# EasyEDA schematic UrLab_badge.json
TITLE: Badge UrLab; REV: 1.0; Date: 2019-04-30; Sheet: 1/1; Drawn By: altf4arnold; Company: UrLab
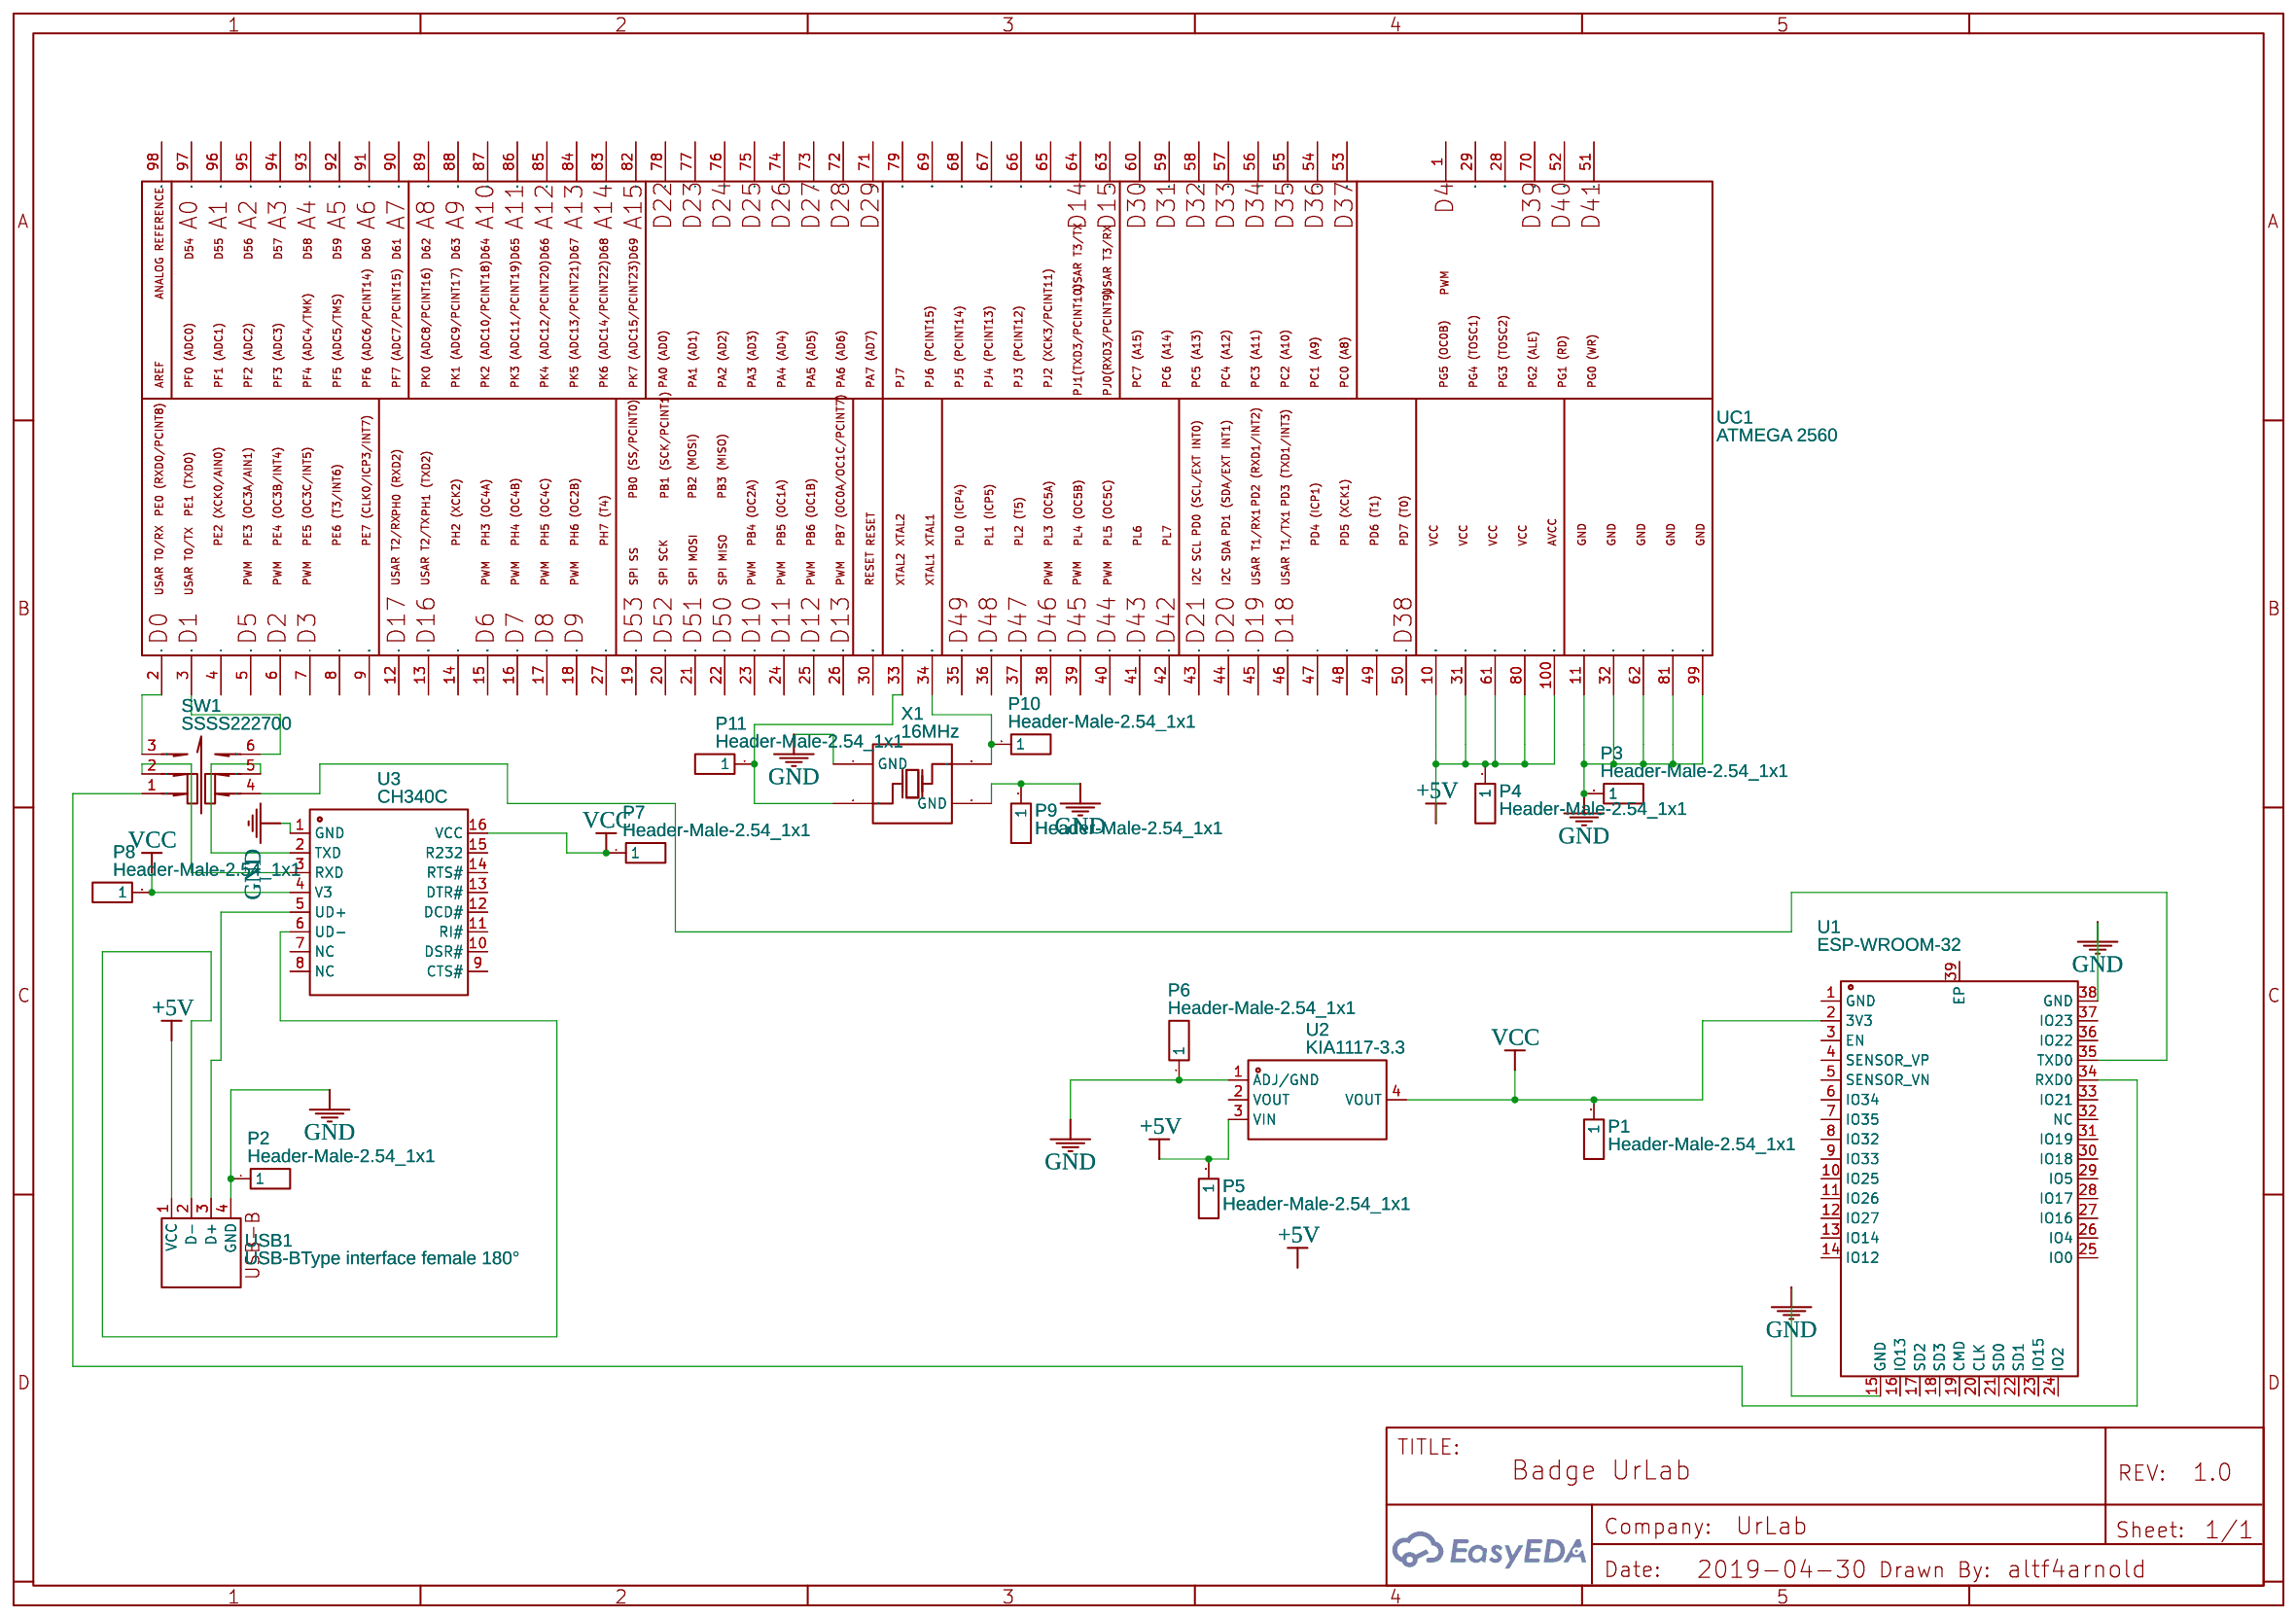
[diagram p0: schematic sheet]

## Parts
P1  Header-Male-2.54_1x1  [HDR-1X1/2.54]
P2  Header-Male-2.54_1x1  [HDR-1X1/2.54]
P3  Header-Male-2.54_1x1  [HDR-1X1/2.54]
P4  Header-Male-2.54_1x1  [HDR-1X1/2.54]
P5  Header-Male-2.54_1x1  [HDR-1X1/2.54]
P6  Header-Male-2.54_1x1  [HDR-1X1/2.54]
P7  Header-Male-2.54_1x1  [HDR-1X1/2.54]
P8  Header-Male-2.54_1x1  [HDR-1X1/2.54]
P9  Header-Male-2.54_1x1  [HDR-1X1/2.54]
P10  Header-Male-2.54_1x1  [HDR-1X1/2.54]
P11  Header-Male-2.54_1x1  [HDR-1X1/2.54]
SW1  SSSS222700  [SW-DIP-9X3.5]
U1  ESP-WROOM-32  [ESP-WROOM-32]
U2  KIA1117-3.3  [SOT-223]
U3  CH340C  [SOP-16_150MIL]
UC1  ATMEGA 2560  [ATMEGA2560]
USB1  USB-BType interface female 180°  [USB-B-1]
X1  16MHz  [SMD-2520_4P]

## Library data of the parts
P1-P11 = -: Supplier: LCSC; Manufacturer: ReliaPro; Supplier Part: C81276
SW1 = -: Supplier: LCSC; Supplier Part: C136144; Manufacturer: ALPS Electric; Contributor: LCSC
U1 = -: Supplier: LCSC; Manufacturer: ESPRESSIF; Supplier Part: C95209
U2 = -: Supplier: LCSC; Manufacturer: KIA; Supplier Part: C116069; LCSC Assembly: Yes
U3 = -: Supplier: LCSC; Manufacturer: WCH; Supplier Part: C84681
UC1 = -: Manufacturer Part: ATMEGA 2560 /1/1; Contributor: jorgeh
USB1 = -: Supplier: LCSC; Supplier Part: C26234
X1 = Q24FA20H00530: Supplier: LCSC; Supplier Part: C255945; Manufacturer: Seiko Epson; Contributor: LCSC

## Nets
+5V: P4.1 P5.1 U2.3(VIN) UC1.10 UC1.31 UC1.61 UC1.80 UC1.100 USB1.1(VCC)
GND: P2.1 P3.1 P6.1 P9.1 U1.15(GND) U1.38(GND) U2.1(ADJ/GND) U3.1(GND) UC1.11 UC1.32 UC1.62 UC1.81 UC1.99 USB1.4(GND) X1.2(GND) X1.4(GND)
VCC: P1.1 P7.1 P8.1 U1.2(3V3) U2.4(VOUT) U3.4(V3) U3.16(VCC)
Net-(P10-1): P10.1 UC1.34 X1.3(OSC2)
Net-(P11-1): P11.1 UC1.33 X1.1(OSC1)
Net-(SW1-1): SW1.1 U1.34(RXD0)
Net-(SW1-2): SW1.2 U3.3(RXD)
Net-(SW1-3): SW1.3 UC1.2
Net-(SW1-4): SW1.4 U1.35(TXD0)
Net-(SW1-5): SW1.5 U3.2(TXD)
Net-(SW1-6): SW1.6 UC1.3
Net-(U3-5): U3.5(UD+) USB1.3(D+)
Net-(U3-6): U3.6(UD-) USB1.2(D-)

Not connected (* = marked no-connect by the designer): U1 1(GND) 3(EN) 4(SENSOR_VP) 5(SENSOR_VN) 6(IO34) 7(IO35) 8(IO32) 9(IO33) 10(IO25) 11(IO26) 12(IO27) 13(IO14) 14(IO12) 16(IO13) 17(SD2) 18(SD3) 19(CMD) 20(CLK) 21(SD0) 22(SD1) 23(IO15) 24(IO2) 25(IO0) 26(IO4) 27(IO16) 28(IO17) 29(IO5) 30(IO18) 31(IO19) 32(NC) 33(IO21) 36(IO22) 37(IO23) 39(EP); U2 2(VOUT); U3 7(NC) 8(NC) 9(CTS#) 10(DSR#) 11(RI#) 12(DCD#) 13(DTR#) 14(RTS#) 15(R232); UC1 1 4 5 6 7 8 9 12 13 14 15 16 17 18 19 20 21 22 23 24 25 26 27 28 29 30 35 36 37 38 39 40 41 42 43 44 45 46 47 48 49 50 51 52 53 54 55 56 57 58 59 60 63 64 65 66 67 68 69 70 71 72 73 74 75 76 77 78 79 82 83 84 85 86 87 88 89 90 91 92 93 94 95 96 97 98
